# EAGLE schematic WLR089U0 Base (EAGLE 9.6.2)
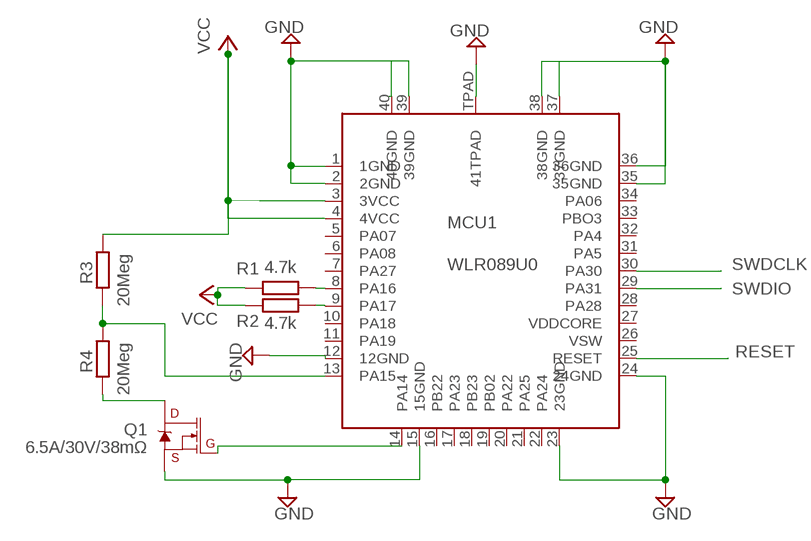
[diagram p0: schematic, sheet 1]

## Parts
MCU1  WLR089U0  [WLR089U0]
Q1  6.5A/30V/38mΩ  MOSFET-NCH-FDS6630A  [SO08]
R1  4.7k  SMK  [SMK]
R2  4.7k  SMK  [SMK]
R3  20Meg  SMK  [SMK]
R4  20Meg  SMK  [SMK]

## Nets
GND: MCU1.1(1GND) MCU1.2(2GND) MCU1.12(12GND) MCU1.15(15GND) MCU1.23(23GND) MCU1.24(24GND) MCU1.35(35GND) MCU1.36(36GND) MCU1.37(37GND) MCU1.38(38GND) MCU1.39(39GND) MCU1.40(40GND) MCU1.TPAD(41TPAD) Q1.1(S) Q1.2(S) Q1.3(S)
N$1: MCU1.8(PA16) R1.1
N$2: MCU1.9(PA17) R2.1
N$3: MCU1.14(PA14) Q1.4(G)
N$4: Q1.5(D) Q1.6(D) Q1.7(D) Q1.8(D) R4.1
N$6: MCU1.13(PA15) R3.1 R4.2
RESET: MCU1.25(RESET)
SWDCLK: MCU1.30(PA30)
SWDIO: MCU1.29(PA31)
VCC: MCU1.3(3VCC) MCU1.4(4VCC) R1.2 R2.2 R3.2
Unconnected: MCU1.5(PA07) MCU1.6(PA08) MCU1.7(PA27) MCU1.10(PA18) MCU1.11(PA19) MCU1.16(PB22) MCU1.17(PA23) MCU1.18(PB23) MCU1.19(PB02) MCU1.20(PA22) MCU1.21(PA25) MCU1.22(PA24) MCU1.26(VSW) MCU1.27(VDDCORE) MCU1.28(PA28) MCU1.31(PA5) MCU1.32(PA4) MCU1.33(PBO3) MCU1.34(PA06)

## Library data of the parts
MCU1 = Personal:WLR089U0: WLR089U0 LoRa Module (ATSAMR34J18B SiP)
Q1 = SparkFun-DiscreteSemi:MOSFET-NCH: N-channel MOSFETs Voltage controlled devices that allow control of high current outputs. SparkFun Products: SparkFun OpenScale <https://www.sparkfun.com/products/13261> SparkFun Digital Sandbox <https://www.sparkfun.com/products/12651> SparkFun Monster Moto Shield <https://www.sparkfun.com/products/10182> SparkFun MOSFET Power Controller <https://www.sparkfun.com/products/11214>; PROD_ID: TRANS-08089
R1-R4 = resistor-shunt:SMK: SMD SHUNT RESISTOR; OC_FARNELL: unknown; OC_NEWARK: unknown